# Altium schematic sheet Nixies-segment-control.SchDoc: =ProjectTitle
size 297 x 209 mm; Address1: Address1; Address2: Address2; Address3: Address3; Address4: Address4; SheetNumber: ?; SheetTotal: ?; Scale: 1:1; DocumentType: Схема электрическая принципиальная; Title2str: ?
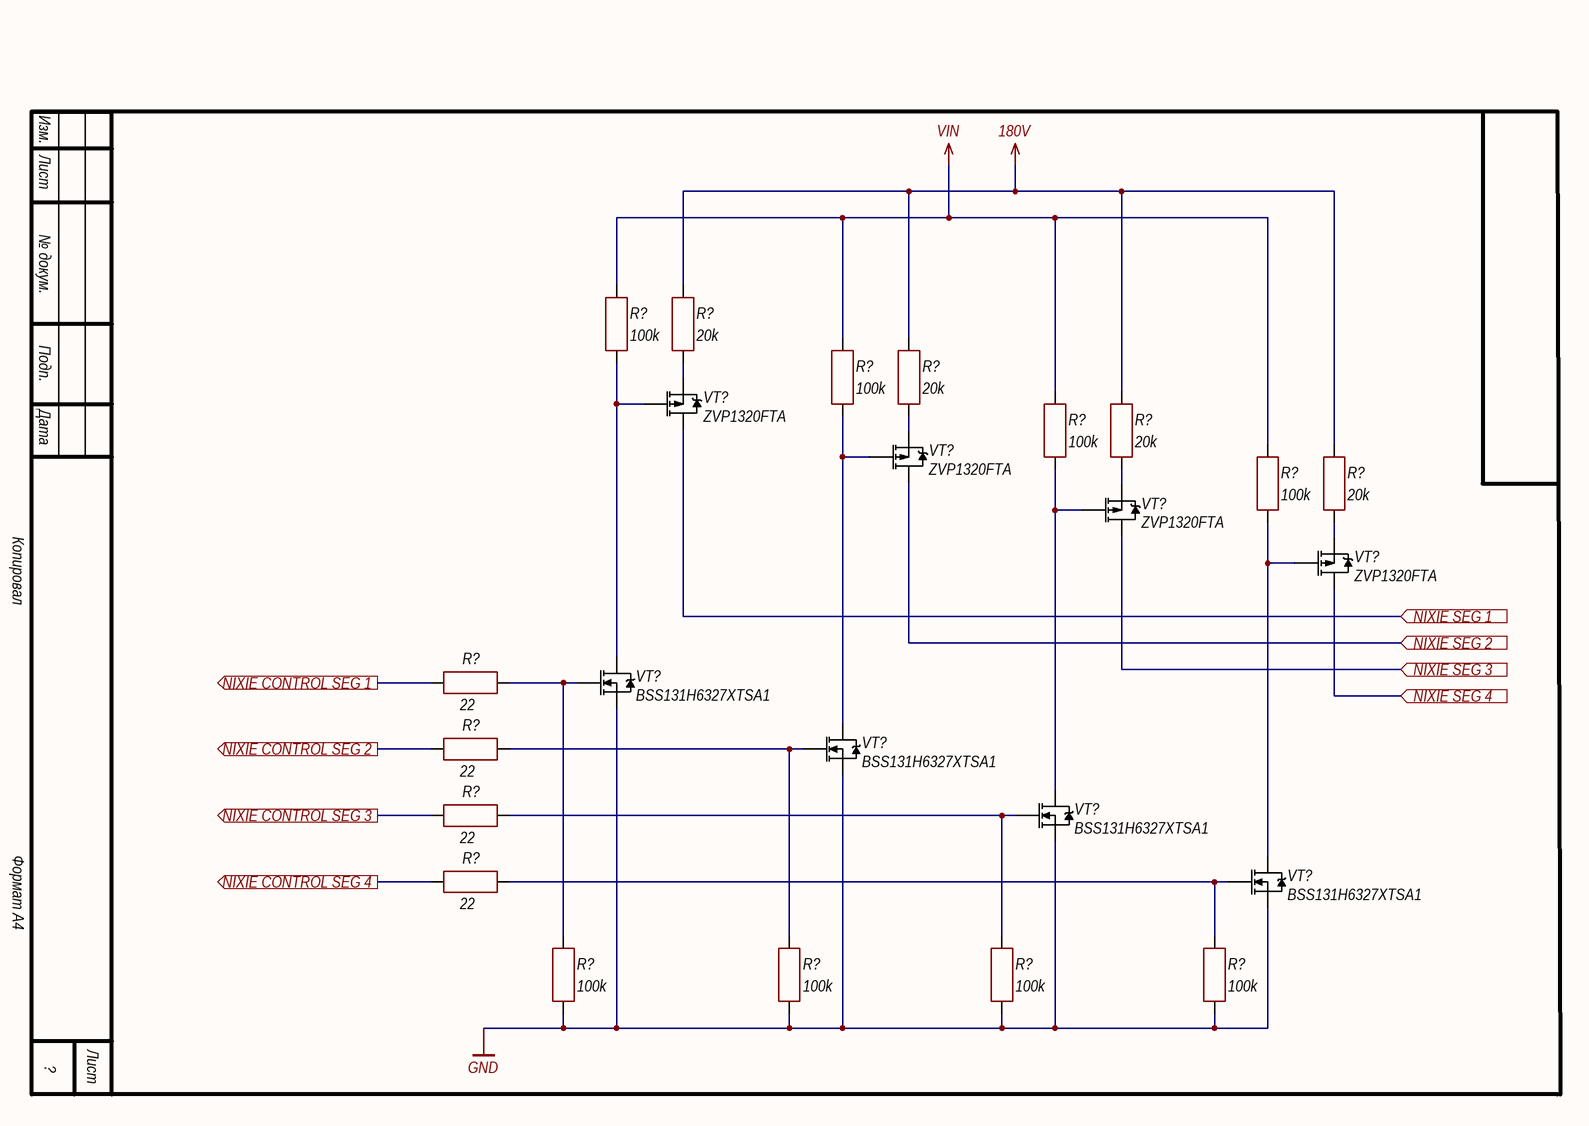
[diagram p0: Nixies-segment-control.SchDoc]

## Parts
(Parts that share a designator on the sheet are numbered #1, #2 ... from top to bottom, then left to right.)
R?#1  100k  [CH0402R]
R?#2  20k  [CH0603R]
R?#3  100k  [CH0402R]
R?#4  20k  [CH0603R]
R?#5  100k  [CH0402R]
R?#6  20k  [CH0603R]
R?#7  100k  [CH0402R]
R?#8  20k  [CH0603R]
R?#9  22  [CH0402R]
R?#10  22  [CH0402R]
R?#11  22  [CH0402R]
R?#12  22  [CH0402R]
R?#13  100k  [CH0402R]
R?#14  100k  [CH0402R]
R?#15  100k  [CH0402R]
R?#16  100k  [CH0402R]
VT?#1  ZVP1320FTA  [SOT23_123]
VT?#2  ZVP1320FTA  [SOT23_123]
VT?#3  ZVP1320FTA  [SOT23_123]
VT?#4  ZVP1320FTA  [SOT23_123]
VT?#5  BSS131H6327XTSA1  [SOT23_123]
VT?#6  BSS131H6327XTSA1  [SOT23_123]
VT?#7  BSS131H6327XTSA1  [SOT23_123]
VT?#8  BSS131H6327XTSA1  [SOT23_123]

## Ports
NIXIE CONTROL SEG 1 (out), NIXIE CONTROL SEG 2 (out), NIXIE CONTROL SEG 3 (out), NIXIE CONTROL SEG 4 (out), NIXIE SEG 1 (in), NIXIE SEG 2 (in), NIXIE SEG 3 (in), NIXIE SEG 4 (in)

## Nets
180V: R?#2.2 R?#4.2 R?#6.2 R?#8.2
GND: R?#13.1 R?#14.1 R?#15.1 R?#16.1 VT?#5.3(S) VT?#6.3(S) VT?#7.3(S) VT?#8.3(S)
VIN: R?#1.2 R?#3.2 R?#5.2 R?#7.2
NIXIE CONTROL SEG 1: R?#9.1 ; port NIXIE CONTROL SEG 1
NIXIE CONTROL SEG 2: R?#10.1 ; port NIXIE CONTROL SEG 2
NIXIE CONTROL SEG 3: R?#11.1 ; port NIXIE CONTROL SEG 3
NIXIE CONTROL SEG 4: R?#12.1 ; port NIXIE CONTROL SEG 4
NIXIE SEG 1: VT?#1.2(D) ; port NIXIE SEG 1
NIXIE SEG 2: VT?#2.2(D) ; port NIXIE SEG 2
NIXIE SEG 3: VT?#3.2(D) ; port NIXIE SEG 3
NIXIE SEG 4: VT?#4.2(D) ; port NIXIE SEG 4
NetR?#1_1: R?#1.1 VT?#1.1(G) VT?#5.2(D)
NetR?#2_1: R?#2.1 VT?#1.3(S)
NetR?#3_1: R?#3.1 VT?#2.1(G) VT?#6.2(D)
NetR?#4_1: R?#4.1 VT?#2.3(S)
NetR?#5_1: R?#5.1 VT?#3.1(G) VT?#7.2(D)
NetR?#6_1: R?#6.1 VT?#3.3(S)
NetR?#7_1: R?#7.1 VT?#4.1(G) VT?#8.2(D)
NetR?#8_1: R?#8.1 VT?#4.3(S)
NetR?#9_2: R?#9.2 R?#13.2 VT?#5.1(G)
NetR?#10_2: R?#10.2 R?#14.2 VT?#6.1(G)
NetR?#11_2: R?#11.2 R?#15.2 VT?#7.1(G)
NetR?#12_2: R?#12.2 R?#16.2 VT?#8.1(G)

## Notes on the sheet
- Изм.
- Лист
- № докум.
- Подп.
- Дата
- Копировал
- Формат А4

## Library data of the parts
R?#1-R?#16 = Resistor: Manufacturer: *; Model: *; HelpURL: *; ComponentKind: *
  R?#1 R?#3 R?#5 R?#7 R?#13-R?#16: Value: 100k
  R?#2 R?#4 R?#6 R?#8: Value: 20k
  R?#9-R?#12: Value: 22
VT?#1-VT?#4 = P-chanel: Mosfet; Manufacturer: Diodes Incorporated; Model: ZVP1320FTA; ComponentKind: -200V, -3.5V, 35mA; HelpURL: https://www.chipdip.ru/product1/8003530329
VT?#5-VT?#8 = N-chanel: Mosfet; Manufacturer: Infineon Technologies Ag; Model: BSS131H6327XTSA1; ComponentKind: 240V. 1.8V, 100mA; HelpURL: https://www.terraelectronica.ru/product/1112834